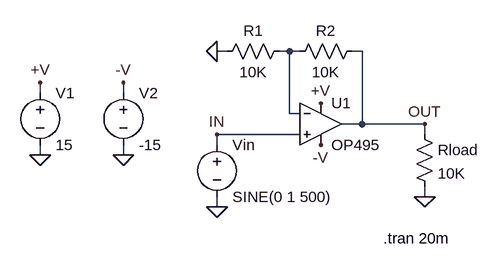
[diagram p0: schematic OP495.asc]
OP495.asc, the LTspice schematic file:
Version 4
SHEET 1 1240 700
WIRE 432 -1216 416 -1216
WIRE 528 -1216 512 -1216
WIRE 544 -1216 528 -1216
WIRE 640 -1216 624 -1216
WIRE 144 -1152 144 -1168
WIRE 272 -1152 272 -1168
WIRE 528 -1120 528 -1216
WIRE 544 -1120 528 -1120
WIRE 640 -1104 640 -1216
WIRE 640 -1104 608 -1104
WIRE 736 -1104 640 -1104
WIRE 544 -1088 416 -1088
WIRE 736 -1088 736 -1104
WIRE 416 -1072 416 -1088
WIRE 144 -1056 144 -1072
WIRE 272 -1056 272 -1072
WIRE 736 -992 736 -1008
WIRE 416 -976 416 -992
FLAG 144 -1168 +V
FLAG 144 -1056 0
FLAG 416 -976 0
FLAG 736 -1104 OUT
FLAG 416 -1088 IN
FLAG 576 -1136 +V
FLAG 272 -1168 -V
FLAG 576 -1072 -V
FLAG 416 -1216 0
FLAG 736 -992 0
FLAG 272 -1056 0
SYMBOL voltage 144 -1168 R0
WINDOW 123 0 0 Left 2
WINDOW 39 0 0 Left 2
SYMATTR InstName V1
SYMATTR Value 15
SYMBOL voltage 416 -1088 R0
WINDOW 123 24 146 Left 2
WINDOW 39 24 125 Left 2
SYMATTR InstName Vin
SYMATTR Value SINE(0 1 500)
SYMBOL res 528 -1232 R90
WINDOW 0 0 56 VBottom 2
WINDOW 3 32 56 VTop 2
SYMATTR InstName R1
SYMATTR Value 10K
SYMBOL res 640 -1232 R90
WINDOW 0 0 56 VBottom 2
WINDOW 3 32 56 VTop 2
SYMATTR InstName R2
SYMATTR Value 10K
SYMBOL Opamps\\OP495 576 -1168 R0
SYMATTR InstName U1
SYMBOL voltage 272 -1168 R0
WINDOW 123 24 146 Left 2
WINDOW 39 24 125 Left 2
SYMATTR InstName V2
SYMATTR Value -15
SYMBOL res 720 -1104 R0
SYMATTR InstName Rload
SYMATTR Value 10K
TEXT 672 -928 Left 2 !.tran 20m

The netlist it stands for:
* OP495.asc
V1 +V 0 15
Vin IN 0 SINE(0 1 500)
R1 N001 0 10K
R2 OUT N001 10K
XU1 IN N001 +V -V OUT OP495  ; pins In+ In- V+ V- OUT
V2 -V 0 -15
Rload OUT 0 10K
.tran 20m
.backanno
.end